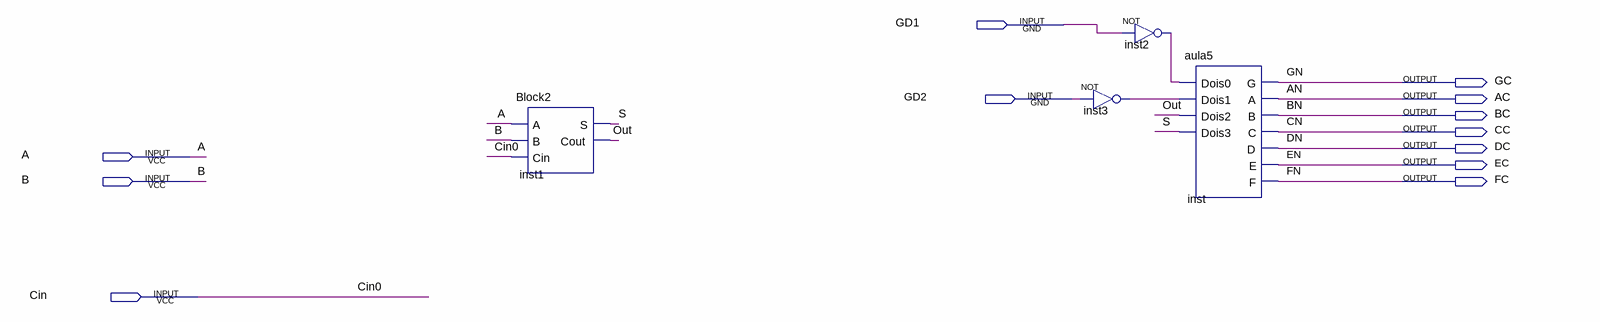
[diagram p0: schematic sheet]
// Quartus schematic aula6.bdf as structural Verilog: 4 symbols, 12 pins
module aula6 (
  input  GD1,
  input  GD2,
  input  A,
  input  B,
  input  Cin,
  output GC,
  output AC,
  output BC,
  output CC,
  output DC,
  output EC,
  output FC
);

  wire inst2_out, inst3_out, Out, S;

  Block2 inst1 (.A(A), .B(B), .Cin(Cin), .S(S), .Cout(Out));
  not inst3 (inst3_out, GD2);
  not inst2 (inst2_out, GD1);
  aula5 inst (
    .Dois0(inst2_out), .Dois1(inst3_out), .Dois2(Out), .Dois3(S), .G(GC), .A(AC), .B(BC), .C(CC), .D(DC),
    .E(EC), .F(FC));

  // Other names for the same wires on the sheet: AN = AC; BN = BC; Cin0 = Cin; CN = CC; DN = DC; EN = EC; FN = FC;
  //   GN = GC
endmodule
